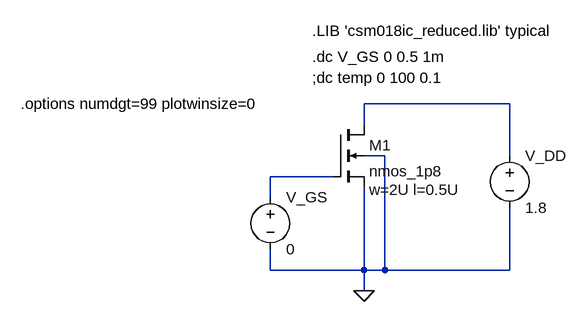
[diagram p0: schematic nmos_sub_threshold.asc]
nmos_sub_threshold.asc, the LTspice schematic file:
Version 4
SHEET 1 880 680
WIRE 512 192 288 192
WIRE 288 224 288 192
WIRE 320 272 288 272
WIRE 512 272 512 192
WIRE 240 304 144 304
WIRE 144 336 144 304
WIRE 144 448 144 416
WIRE 288 448 288 320
WIRE 288 448 144 448
WIRE 320 448 320 272
WIRE 320 448 288 448
WIRE 512 448 512 352
WIRE 512 448 320 448
WIRE 288 480 288 448
FLAG 288 480 0
SYMBOL nmos4 240 224 R0
WINDOW 123 56 100 Left 2
SYMATTR Value2 w=2U l=0.5U
SYMATTR InstName M1
SYMATTR Value nmos_1p8
SYMBOL voltage 512 256 R0
SYMATTR InstName V_DD
SYMATTR Value 1.8
SYMBOL voltage 144 320 R0
WINDOW 123 0 0 Left 0
WINDOW 39 0 0 Left 0
SYMATTR InstName V_GS
SYMATTR Value 0
TEXT 208 80 Left 2 !.LIB 'csm018ic_reduced.lib' typical
TEXT 208 120 Left 2 !.dc V_GS 0 0.5 1m
TEXT -240 192 Left 2 !.options numdgt=99 plotwinsize=0
TEXT 208 152 Left 2 !;dc temp 0 100 0.1

The netlist it stands for:
* nmos_sub_threshold.asc
M1 N001 N002 0 0 nmos_1p8 w=2U l=0.5U
V_DD N001 0 1.8
V_GS N002 0 0
.model NMOS NMOS
.model PMOS PMOS
.lib standard.mos
.LIB 'csm018ic_reduced.lib' typical
.dc V_GS 0 0.5 1m
.options numdgt=99 plotwinsize=0
;dc temp 0 100 0.1
.backanno
.end